# Altium schematic sheet S7CAS-PLEIADES-CARTE-MERE_P01_FPGA-BANK5.SchDoc
size Tabloid; DocumentNumber: 16; SheetNumber: 16; SheetTotal: 17; Sheet_Name: FPGA - BANK 5; Size: 11x17
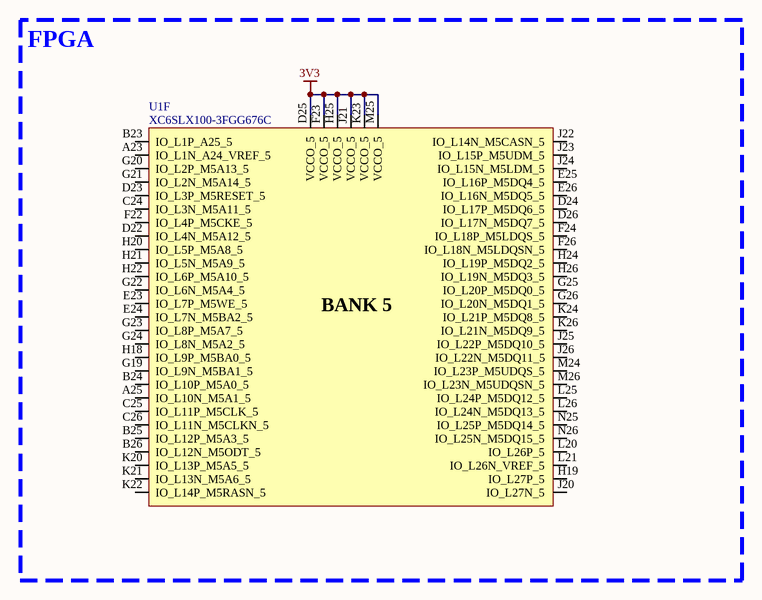
[diagram p0: S7CAS-PLEIADES-CARTE-MERE_P01_FPGA-BANK5.SchDoc]

## Parts
U1  XC6SLX100-3FGG676C  [FPGA_XILINX_FGG676]  (part F of 10)

## Blocks framed on the sheet
FPGA: U1

## Nets
3V3: U1.D25(VCCO_5) U1.F23(VCCO_5) U1.H25(VCCO_5) U1.J21(VCCO_5) U1.K23(VCCO_5) U1.M25(VCCO_5)

Not connected (* = marked no-connect by the designer): U1 A23(IO_L1N_A24_VREF_5) A25(IO_L10N_M5A1_5) B23(IO_L1P_A25_5) B24(IO_L10P_M5A0_5) B25(IO_L12P_M5A3_5) B26(IO_L12N_M5ODT_5) C24(IO_L3N_M5A11_5) C25(IO_L11P_M5CLK_5) C26(IO_L11N_M5CLKN_5) D22(IO_L4N_M5A12_5) D23(IO_L3P_M5RESET_5) D24(IO_L17P_M5DQ6_5) D26(IO_L17N_M5DQ7_5) E23(IO_L7P_M5WE_5) E24(IO_L7N_M5BA2_5) E25(IO_L16P_M5DQ4_5) E26(IO_L16N_M5DQ5_5) F22(IO_L4P_M5CKE_5) F24(IO_L18P_M5LDQS_5) F26(IO_L18N_M5LDQSN_5) G19(IO_L9N_M5BA1_5) G20(IO_L2P_M5A13_5) G21(IO_L2N_M5A14_5) G22(IO_L6N_M5A4_5) G23(IO_L8P_M5A7_5) G24(IO_L8N_M5A2_5) G25(IO_L20P_M5DQ0_5) G26(IO_L20N_M5DQ1_5) H18(IO_L9P_M5BA0_5) H19(IO_L27P_5) H20(IO_L5P_M5A8_5) H21(IO_L5N_M5A9_5) H22(IO_L6P_M5A10_5) H24(IO_L19P_M5DQ2_5) H26(IO_L19N_M5DQ3_5) J20(IO_L27N_5) J22(IO_L14N_M5CASN_5) J23(IO_L15P_M5UDM_5) J24(IO_L15N_M5LDM_5) J25(IO_L22P_M5DQ10_5) J26(IO_L22N_M5DQ11_5) K20(IO_L13P_M5A5_5) K21(IO_L13N_M5A6_5) K22(IO_L14P_M5RASN_5) K24(IO_L21P_M5DQ8_5) K26(IO_L21N_M5DQ9_5) L20(IO_L26P_5) L21(IO_L26N_VREF_5) L25(IO_L24P_M5DQ12_5) L26(IO_L24N_M5DQ13_5) M24(IO_L23P_M5UDQS_5) M26(IO_L23N_M5UDQSN_5) N25(IO_L25P_M5DQ14_5) N26(IO_L25N_M5DQ15_5)

## Notes on the sheet
- Sheet Name
- Project Title
- Global Project
- Size
- Group
- Revision
- Date
- Sheet
- of
- Filename
- Designers
- (in symbol FPGA_XC6SLX100-3FGG676C, part F) BANK 5

## Library data of the parts
U1 = FPGA_XC6SLX100-3FGG676C: FPGA - XILINX SPARTAN 6 480 I/O - BGA-676; Voltage: 1.14 V ~ 1.26 V; Current: *; Power: *; Mfg: Xilinx; Mfg Part Number: XC6SLX100-3FGG676C; HelpURL: https://www.xilinx.com/support/documentation/data_sheets/ds162.pdf; CreatedBy: Jonathan Bouchard; Temperature: 0°C ~ 85°C (TJ); Value: *; Precision: *; Package: BGA-676; Supplier 1: Digikey; Supplier Part Number 1: 122-1760-ND; Part Number #1: XC6SLX100-3FGG676C